# Altium schematic sheet External.SchDoc
size 259 x 167 mm; SheetNumber: 1; SheetTotal: 2
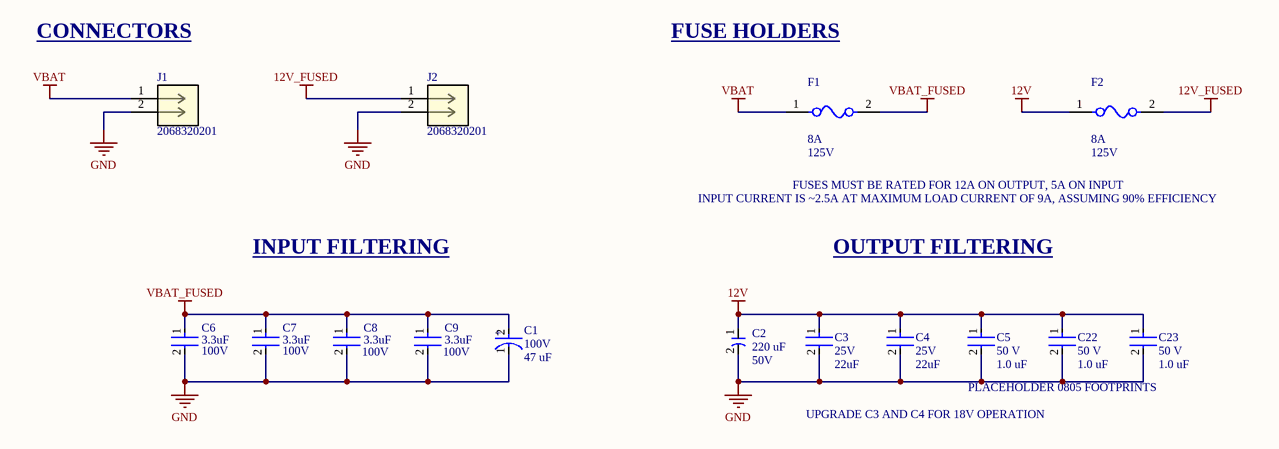
[diagram p0: External.SchDoc]

## Parts
C1  Voltage: 100V  Capacitance: 47 uF  [PCAP_10x10-ELECT_NCA]  (hidden comment: UUX2A470MNL1GS)
C2  Capacitance: 220 uF  Voltage Rating: 50V  [ELEC-220U-0003]  (hidden comment: 50TZV220M10X10.5)
C3  Voltage: 25V  Capacitance: 22uF  [CAP-1210]  (hidden comment: GRM32ER61E226KE15L)
C4  Voltage: 25V  Capacitance: 22uF  [CAP-1210]  (hidden comment: GRM32ER61E226KE15L)
C5  Voltage: 50 V  Capacitance: 1.0 uF  [CAP-0805]  (hidden comment: CC0805KKX7R9BB105)
C6  Capacitance: 3.3uF  Voltage: 100V  [CAP-1206]  (hidden comment: C3216X7S2A335K160AB)
C7  Capacitance: 3.3uF  Voltage: 100V  [CAP-1206]  (hidden comment: C3216X7S2A335K160AB)
C8  Capacitance: 3.3uF  Voltage: 100V  [CAP-1206]  (hidden comment: C3216X7S2A335K160AB)
C9  Capacitance: 3.3uF  Voltage: 100V  [CAP-1206]  (hidden comment: C3216X7S2A335K160AB)
C22  Voltage: 50 V  Capacitance: 1.0 uF  [CAP-0805]  (hidden comment: CC0805KKX7R9BB105)
C23  Voltage: 50 V  Capacitance: 1.0 uF  [CAP-0805]  (hidden comment: CC0805KKX7R9BB105)
F1  Fuse Current: 8A  Voltage Rating: 125V  [FUSE-0001]  (hidden comment: 01550900M)
F2  Fuse Current: 8A  Voltage Rating: 125V  [FUSE-0001]  (hidden comment: 01550900M)
J1  2068320201  [CONN_2068320000-SD_02_MOL]
J2  2068320201  [CONN_2068320000-SD_02_MOL]

## Nets
12V: C2.1 C3.1 C4.1 C5.1 C22.1 C23.1 F2.1
12V_FUSED: F2.2 J2.1
GND: C1.1(C) C2.2 C3.2 C4.2 C5.2 C6.2 C7.2 C8.2 C9.2 C22.2 C23.2 J1.2 J2.2
VBAT: F1.1 J1.1
VBAT_FUSED: C1.2(A) C6.1 C7.1 C8.1 C9.1 F1.2

## Notes on the sheet
- CONNECTORS
- FUSE HOLDERS
- INPUT CURRENT IS ~2.5A AT MAXIMUM LOAD CURRENT OF 9A, ASSUMING 90% EFFICIENCY
- FUSES MUST BE RATED FOR 12A ON OUTPUT, 5A ON INPUT
- INPUT FILTERING
- OUTPUT FILTERING
- PLACEHOLDER 0805 FOOTPRINTS
- UPGRADE C3 AND C4 FOR 18V OPERATION
- (in symbol CAP-47U-0005) +

## Library data of the parts
C1 = CAP-47U-0005: 47 µF 100 V Aluminum Electrolytic Capacitors Radial, Can - SMD 2000 Hrs @ 105°C; Device Class: Electrolytic; ComponentLink1Description: Datasheet; ComponentLink1URL: https://industrial.panasonic.com/cdbs/www-data/pdf/RDD0000/ABA0000C1234.pdf
C2 = ELEC-220U-0003: 220 µF 50 V Aluminum Electrolytic Capacitors Radial, Can - SMD 2000 Hrs @ 105°C; Size: .406inx.406in*.413in
C3 C4 = CAP-22U-0001: CAP CER 22UF 25V X5R 1210; ComponentLink2Description: Datasheet; ComponentLink2URL: https://search.murata.co.jp/Ceramy/image/img/A01X/G101/ENG/GRM32ER61E226KE15-01A.pdf; Device Class: Ceramic; Size: 1210
C5 C22 C23 = CAP-1U-0001: CAP CER 1UF 50V X7R 0805; ComponentLink2URL: https://www.yageo.com/upload/media/product/productsearch/datasheet/mlcc/UPY-GPHC_X7R_6.3V-to-250V_24.pdf; ComponentLink2Description: Datasheet; Device Class: Ceramic; Size: 0805
C6-C9 = CAP-3.3U-0001: CAP CER 3.3UF 100V X7S 1206; Device Class: Ceramic; Size: 1206; ComponentLink1Description: Datasheet; ComponentLink1URL: https://www.yageo.com/upload/media/product/productsearch/datasheet/mlcc/UPY-GPHC_X7R_6.3V-to-250V_24.pdf
F1 F2 = FUSE-0001: FUSE BLOK CARTRIDGE 125V 10A SMD; ComponentLink2Description: Datasheet; ComponentLink2URL: https://www.littelfuse.com/~/media/electronics/datasheets/fuses/littelfuse_fuse_154_154t_154l_154tl_datasheet.pdf.pdf
J1 J2 = 2068320201: Micro-Fit+ Vertical Header, Through Hole, 3.00mm Pitch, Dual Row, 2 Circuits, Tin (Sn) Plating, Glow-Wire Capable, Black, Tray; Manufacturer_Name: Molex Connector Corporation; Copyright: Copyright (C) 2025 Ultra Librarian. All rights reserved.; Manufacturer_Part_Number: 2068320201; RefDes: RefDes; Type: Type